# Altium schematic sheet BLDC-PWR-CONROLLER.SchDoc
size 420 x 297 mm; DocumentNumber: АБВГ.000000.000 Э3; SheetNumber: 4; PageSetup: Record=PageOptions|CenterHorizontal=False|CenterVertical=False|PrintScale=0.95|XCorrection=0.00|YCorrection=0.00|PrintKind=1|BorderSize=5000000|LeftOffset=0|BottomOffset=0|Orientation=1|PaperLength=1000|PaperWidth=1000|Scale=100|PaperSource=15|PrintQuality=600|MediaType=1|DitherType=10|PaperKind=A4|PrintScaleMode=1; Letter1Column: {}; Letter2Column: {}; Letter3Column: {}; ProcessInspection: ProcessInspection; EngineerName: EngineerName; NormInspection: NormInspection; DocumentType: DocumentType; Mass: Mass; Scale: Scale; Developer1size1str: Developer1size1str; Developer2size1str: Developer2size1str; Developer2size2str: Developer2size2str; Title1size1str: Title1size1str; Title2size1str: Title2size1str; Title2size2str: Title2size2str; Title3size3str: Title3size3str; Title3size2str: Title3size2str; Title3size1str: Title3size1str; FunctionalGroup: #_
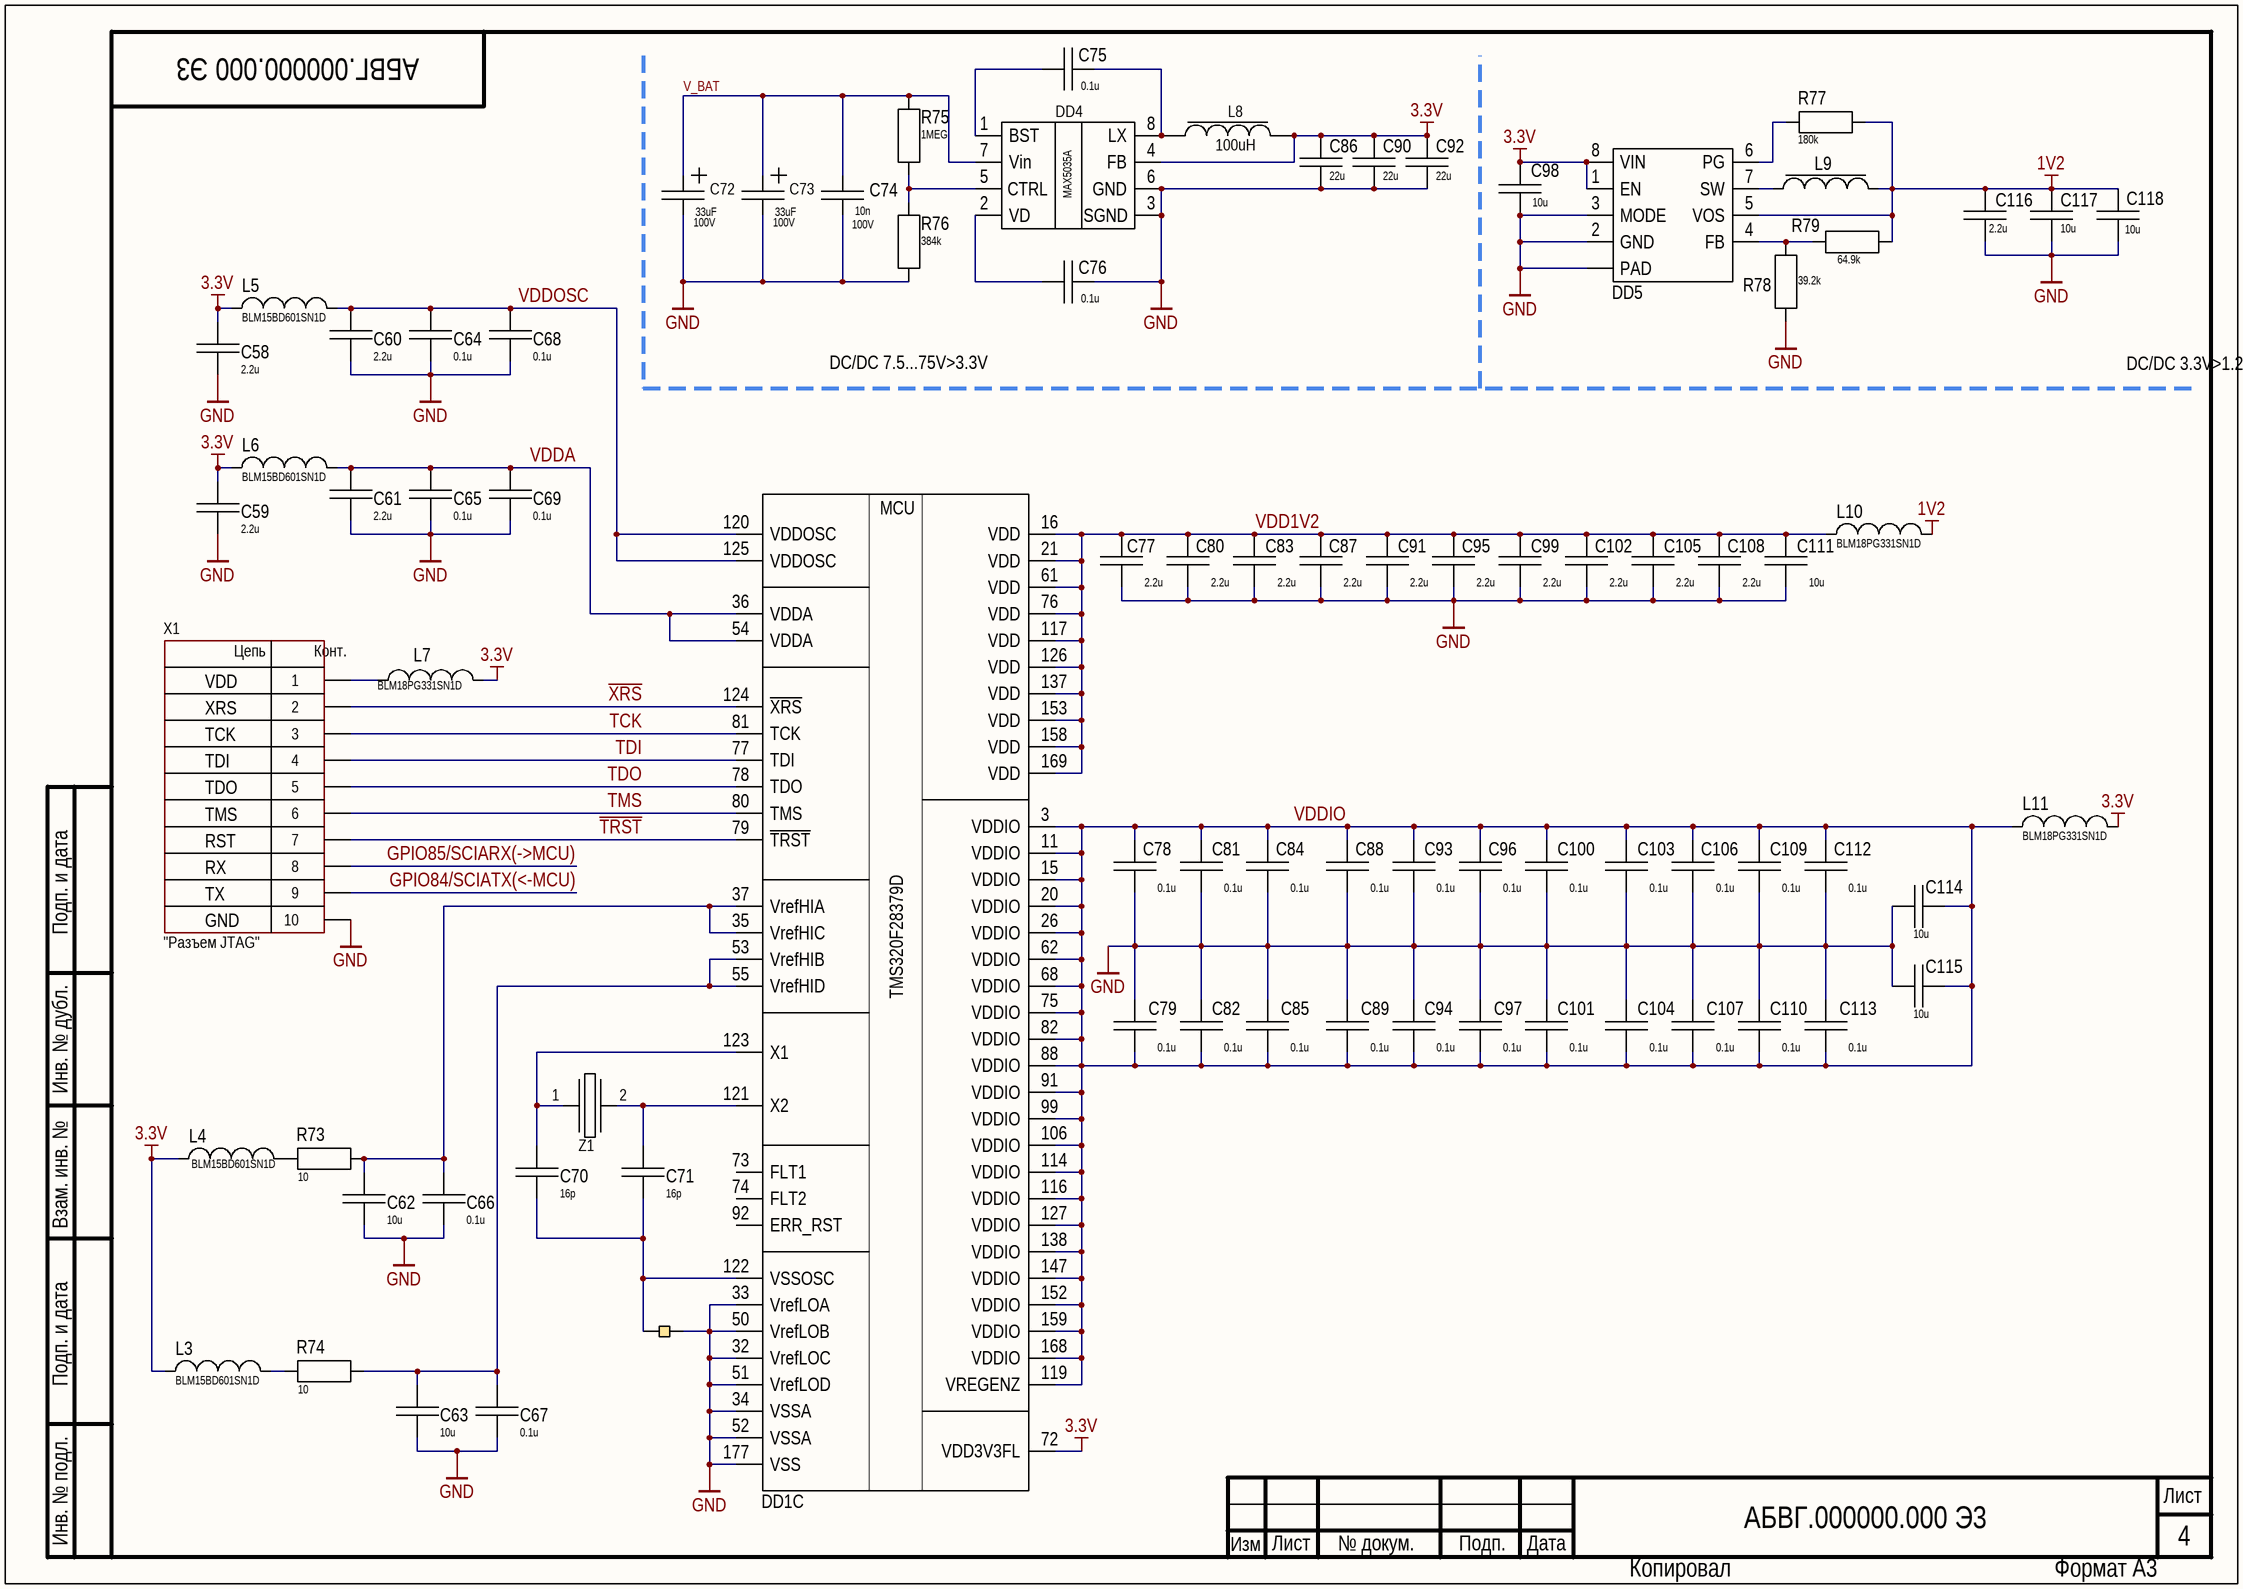
[diagram p0: BLDC-PWR-CONROLLER.SchDoc]

## Parts
C58  2.2u  [CAP: 0402]
C59  2.2u  [CAP: 0402]
C60  2.2u  [CAP: 0402]
C61  2.2u  [CAP: 0402]
C62  10u  [CAP: 0402]
C63  10u  [CAP: 0402]
C64  0.1u  [CAP: 0402]
C65  0.1u  [CAP: 0402]
C66  0.1u  [CAP: 0402]
C67  0.1u  [CAP: 0402]
C68  0.1u  [CAP: 0402]
C69  0.1u  [CAP: 0402]
C70  16p  [CAP: 0402]
C71  16p  [CAP: 0402]
C72  value 33uF  Voltage: 100V  [ECR08]  (hidden comment: ECR0812)
C73  value 33uF  Voltage: 100V  [ECR08]  (hidden comment: ECR0812)
C74  value 10n  Voltage: 100V  [CAP: 0603]
C75  0.1u  [CAP: 0402]
C76  0.1u  [CAP: 0402]
C77  2.2u  [CAP: 0402]
C78  0.1u  [CAP: 0402]
C79  0.1u  [CAP: 0402]
C80  2.2u  [CAP: 0402]
C81  0.1u  [CAP: 0402]
C82  0.1u  [CAP: 0402]
C83  2.2u  [CAP: 0402]
C84  0.1u  [CAP: 0402]
C85  0.1u  [CAP: 0402]
C86  22u  [CAP: 0805]
C87  2.2u  [CAP: 0402]
C88  0.1u  [CAP: 0402]
C89  0.1u  [CAP: 0402]
C90  22u  [CAP: 0805]
C91  2.2u  [CAP: 0402]
C92  22u  [CAP: 0805]
C93  0.1u  [CAP: 0402]
C94  0.1u  [CAP: 0402]
C95  2.2u  [CAP: 0402]
C96  0.1u  [CAP: 0402]
C97  0.1u  [CAP: 0402]
C98  10u  [CAP: 0805]
C99  2.2u  [CAP: 0402]
C100  0.1u  [CAP: 0402]
C101  0.1u  [CAP: 0402]
C102  2.2u  [CAP: 0402]
C103  0.1u  [CAP: 0402]
C104  0.1u  [CAP: 0402]
C105  2.2u  [CAP: 0402]
C106  0.1u  [CAP: 0402]
C107  0.1u  [CAP: 0402]
C108  2.2u  [CAP: 0402]
C109  0.1u  [CAP: 0402]
C110  0.1u  [CAP: 0402]
C111  10u  [CAP: 0402]
C112  0.1u  [CAP: 0402]
C113  0.1u  [CAP: 0402]
C114  10u  [CAP: 0402]
C115  10u  [CAP: 0402]
C116  2.2u  [CAP: 0402]
C117  10u  [CAP: 0805]
C118  10u  [CAP: 0805]
DD1  TMS320F28379DPTP_LACID  [176-HLQFP]  (value not drawn)  (part C of 3)
DD4  MAX5035A  [SOIC-8-150-1.27]
DD5  TPS62080ADSGT  [8-WSON 2.1x2.1]  (value not drawn)
L3  BLM15BD601SN1D  [IND: 0402]
L4  BLM15BD601SN1D  [IND: 0402]
L5  BLM15BD601SN1D  [IND: 0402]
L6  BLM15BD601SN1D  [IND: 0402]
L7  BLM18PG331SN1D  [IND: 0603]
L8  value 100uH  [IND: SRR1208]
L9  LQH3NPN  [IND: LQH3NP]  (value not drawn)
L10  BLM18PG331SN1D  [IND: 0603]
L11  BLM18PG331SN1D  [IND: 0603]
NT19  (no value)  [CON: NT]
R73  10  [RES: 0402]
R74  10  [RES: 0402]
R75  1MEG  [RES: 0402]
R76  384k  [RES: 0402]
R77  180k  [RES: 0402]
R78  39.2k  [RES: 0402]
R79  64.9k  [RES: 0402]
X1  CommentText: "Разъем JTAG"  [CON: PLD-10]
Z1  (no value)  [OSC: HC49SM]

## Nets
1V2: C116.2 C117.2 C118.2 DD5.5(VOS) L9.1 L10.2 R77.1 R79.1
3.3V: C58.2 C59.2 C86.2 C90.2 C92.2 C98.2 DD1.72(VDD3V3FL) DD4.4(FB) DD5.1(EN) DD5.8(VIN) L3.1 L4.1 L5.1 L6.1 L7.1 L8.1 L11.2
GND: C58.1 C59.1 C60.1 C61.1 C62.1 C63.1 C64.1 C65.1 C66.1 C67.1 C68.1 C69.1 C72.2 C73.2 C74.1 C76.1 C77.1 C78.1 C79.2 C80.1 C81.1 C82.2 C83.1 C84.1 C85.2 C86.1 C87.1 C88.1 C89.2 C90.1 C91.1 C92.1 C93.1 C94.2 C95.1 C96.1 C97.2 C98.1 C99.1 C100.1 C101.2 C102.1 C103.1 C104.2 C105.1 C106.1 C107.2 C108.1 C109.1 C110.2 C111.1 C112.1 C113.2 C114.2 C115.2 C116.1 C117.1 C118.1 DD1.32(VrefLOC) DD1.33(VrefLOA) DD1.34(VSSA) DD1.50(VrefLOB) DD1.51(VrefLOD) DD1.52(VSSA) DD1.177(VSS) DD4.3(SGND) DD4.6(GND) DD5.0(PAD) DD5.2(GND) DD5.3(MODE) NT19.2 R76.1 R78.1 X1.10
GPIO84/SCIATX(<-MCU): X1.9
GPIO85/SCIARX(->MCU): X1.8
~{TRST}: DD1.79(~{TRST}) X1.7
TCK: DD1.81(TCK) X1.3
TDI: DD1.77(TDI) X1.4
TDO: DD1.78(TDO) X1.5
TMS: DD1.80(TMS) X1.6
V_BAT: C72.1 C73.1 C74.2 DD4.7(Vin) R75.2
VDD1V2: C77.2 C80.2 C83.2 C87.2 C91.2 C95.2 C99.2 C102.2 C105.2 C108.2 C111.2 DD1.16(VDD) DD1.21(VDD) DD1.61(VDD) DD1.76(VDD) DD1.117(VDD) DD1.126(VDD) DD1.137(VDD) DD1.153(VDD) DD1.158(VDD) DD1.169(VDD) L10.1
VDDA: C61.2 C65.2 C69.2 DD1.36(VDDA) DD1.54(VDDA) L6.2
VDDIO: C78.2 C79.1 C81.2 C82.1 C84.2 C85.1 C88.2 C89.1 C93.2 C94.1 C96.2 C97.1 C100.2 C101.1 C103.2 C104.1 C106.2 C107.1 C109.2 C110.1 C112.2 C113.1 C114.1 C115.1 DD1.3(VDDIO) DD1.11(VDDIO) DD1.15(VDDIO) DD1.20(VDDIO) DD1.26(VDDIO) DD1.62(VDDIO) DD1.68(VDDIO) DD1.75(VDDIO) DD1.82(VDDIO) DD1.88(VDDIO) DD1.91(VDDIO) DD1.99(VDDIO) DD1.106(VDDIO) DD1.114(VDDIO) DD1.116(VDDIO) DD1.119(VREGENZ) DD1.127(VDDIO) DD1.138(VDDIO) DD1.147(VDDIO) DD1.152(VDDIO) DD1.159(VDDIO) DD1.168(VDDIO) L11.1
VDDOSC: C60.2 C64.2 C68.2 DD1.120(VDDOSC) DD1.125(VDDOSC) L5.2
~{XRS}: DD1.124(~{XRS}) X1.2
NetC62_2: C62.2 C66.2 DD1.35(VrefHIC) DD1.37(VrefHIA) R73.1
NetC63_2: C63.2 C67.2 DD1.53(VrefHIB) DD1.55(VrefHID) R74.1
NetC70_1: C70.1 C71.1 DD1.122(VSSOSC) NT19.1
NetC70_2: C70.2 DD1.123(X1) Z1.1
NetC71_2: C71.2 DD1.121(X2) Z1.2
NetC75_1: C75.1 DD4.8(LX) L8.2
NetC75_2: C75.2 DD4.1(BST)
NetC76_2: C76.2 DD4.2(VD)
NetDD4_5: DD4.5(CTRL) R75.1 R76.2
NetDD5_4: DD5.4(FB) R78.2 R79.2
NetDD5_6: DD5.6(PG) R77.2
NetDD5_7: DD5.7(SW) L9.2
NetL3_2: L3.2 R74.2
NetL4_2: L4.2 R73.2
NetL7_2: L7.2 X1.1

Not connected (* = marked no-connect by the designer): DD1 73(FLT1) 74(FLT2) 92(ERR_RST)

## Notes on the sheet
- DC/DC 7.5...75V>3.3V
- DC/DC 3.3V>1.2V
- XRS
- VDD
- TDO
- TDI
- TCK
- RST
- TMS
- GND
- RX
- TX
- Подп. и дата
- Инв. № дубл.
- Взам. инв. №
- Инв. № подл.
- Лист
- Изм
- № докум.
- Подп.
- Дата
- Копировал
- Формат А3
- (in symbol PLD-10) Цепь; Конт.
- (in symbol TMS320F28379DPTP_LACID, part C) MCU; TMS320F28379D

## Library data of the parts
C58-C63 C77 C80 C83 C87 C91 C95 C99 C102 C105 C108 C111 C114-C116 = CAP 0402: PartNumber: CC0402MRX5R5BB106; Voltage: 6.3V
  C58-C61 C77 C80 C83 C87 C91 C95 C99 C102 C105 C108 C116: Value: 2.2u
  C62 C63 C111 C114 C115: Value: 10u
C64-C69 C78 C79 C81 C82 C84 C85 C88 C89 C93 C94 C96 C97 C100 C101 C103 C104 C106 C107 C109 C110 C112 C113 = CAP 0402: PartNumber: C0402C104K8PAC; Manufacturer: Kemet; Voltage: 10V; Type: Capacitor; Temperature_Range: -55/+85; Tolerance: 10%; Value: 0.1u; Case: 0402
C70 C71 = CAP 0402: PartNumber: GRM1555C1H160JA01D; Manufacturer: Kemet; Voltage: 50V; Type: Capacitor; Temperature_Range: -55/+85; Tolerance: 10%; Value: 16p; Case: 0402
C72 C73 = ECR0812: PartNumber: JRB2A330M03500800120000B; Case: 8x12; Link: https://www.chipdip.by/product0/9000565862
C74 = Ceramic_0603: Manufacturer: murata; PartNumber: GRM188R72A103KA01D; ValueManufacturerPartNumber: Ceramic capacitor, 10n, X7R, ±10%, 100V, 0603, -55...+125°C; TypeCapacitor: Ceramic capacitor; Tolerance: ±10%; TypeDielectric: X7R; Package: 0603; HelpURL: https://www.chipdip.by/product/grm188r72a103ka01d; Temperature: -55...+125°C
C75 C76 = CAP 0402: Manufacturer: Kemet; Voltage: 100V; Type: Capacitor; Temperature_Range: -55/+85; Tolerance: 10%; Value: 0.1u; Case: 0402
C86 C90 C92 = CAP 0805: PartNumber: GRM21BR60J226M*; Voltage: 6.3V; Value: 22u
C98 C117 C118 = CAP 0805: PartNumber: CC0402MRX5R5BB106; Voltage: 6.3V; Value: 10u
DD1 = TMS320F28379DPTP_LACID: PartNumber: TMS320F28379DPTPT; Case: HLQFP-176
DD4 = MAX5035*
DD5 = TPS62080ADSGT: PartNumber: TPS61023DRLR
L8 = Inductor_SRR1208: Manufacturer: EPCOS; PartNumber: B82477G4104M000; TypeInductor: Fixed inductor; MaxCurrent: 1.7A; Tolerance: 20%; Link: https://www.chipdip.by/product/b82477g4104m; Temperature: -40...+150°C
L9 = LQH3NPN: PartNumber: LQH3NPN1R0NJ0L; Type: Chip Coil; Value: 1uH; Case: 1212; Max DC current: *
NT19 = NT
R73 R74 = RES 0402: PartNumber: RC0402FR-071KL; Tolerance: 1%; Value: 10; Manufacturer: *; Type: Resistor; Temperature_Range: *; Composition: *; Voltage: *; Case: 0402
R75 R76 R78 = RES 0402: PartNumber: RC0402FR-1339K2L; Tolerance: 1%; Manufacturer: *; Type: Resistor; Temperature_Range: *; Composition: *; Voltage: *; Case: 0402
  R75: Value: 1MEG
  R76: Value: 384k
  R78: Value: 39.2k
R77 = RES 0402: PartNumber: RC0402FR-07180RL; Tolerance: 1%; Value: 180k; Manufacturer: *; Type: Resistor; Temperature_Range: *; Composition: *; Voltage: *; Case: 0402
R79 = RES 0402: PartNumber: RC0402FR-1364K9L; Tolerance: 1%; Value: 64.9k; Manufacturer: *; Type: Resistor; Temperature_Range: *; Composition: *; Voltage: *; Case: 0402
X1 = PLD-10: Manufacturer: Connfly; ValueManufacturerPartNumber: Connector, 10pin, 2.54mm, 500VAC, 3A; TypeConnector: Connector; VoltageMax: 500VAC; Pitch: 2.54mm; CurrentMax: 3A; Multichannel: 10pin; HelpURL: https://www.chipdip.ru/product/pld-10; PartNumber: PLD-10
Z1 = Crystal_HC-49SM: Manufacturer: Epson; PartNumber: FC-135 32.7680KA-A5; ValueManufacturerPartNumber: Crystal, , 12.5pF, ±20ppm, case 3215, -40...+85°C; LoadCapacitance: 12.5pF; Tolerance: ±20ppm; Package: case 3215; HelpURL: https://www.digikey.com/product-detail/en/epson/FC-135-32.7680KA-A5/SER4103CT-ND/6188447; Temperature: -40...+85°C; TypeOscilator: Crystal
L3-L6 = BLM15BD601SN1D: PartNumber: BLM15BD601SN1D
L7 L10 L11 = BLM18PG331SN1D: PartNumber: BLM18PG331SN1D